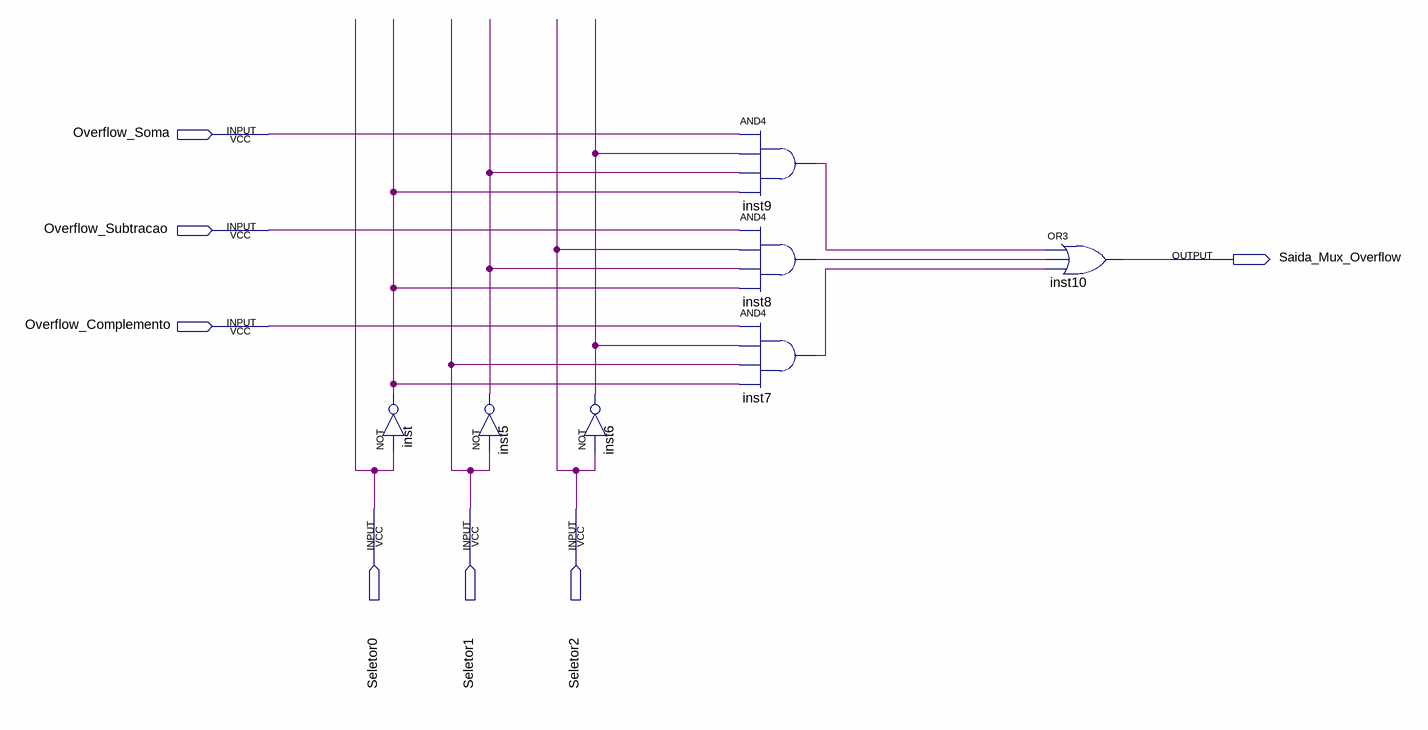
[diagram p0: schematic sheet]
// Quartus schematic MUX_OVERFLOW.bdf as structural Verilog: 7 symbols, 7 pins
module MUX_OVERFLOW (
  input  Overflow_Soma,
  input  Overflow_Subtracao,
  input  Overflow_Complemento,
  input  Seletor0,
  input  Seletor1,
  input  Seletor2,
  output Saida_Mux_Overflow
);

  wire inst5_out, inst6_out, inst7_out, inst8_out, inst9_out, inst_out;

  not inst (inst_out, Seletor0);
  not inst5 (inst5_out, Seletor1);
  not inst6 (inst6_out, Seletor2);
  and inst9 (inst9_out, Overflow_Soma, inst6_out, inst5_out, inst_out);
  and inst8 (inst8_out, Overflow_Subtracao, Seletor2, inst5_out, inst_out);
  and inst7 (inst7_out, Overflow_Complemento, inst6_out, Seletor1, inst_out);
  or inst10 (Saida_Mux_Overflow, inst9_out, inst8_out, inst7_out);
endmodule
